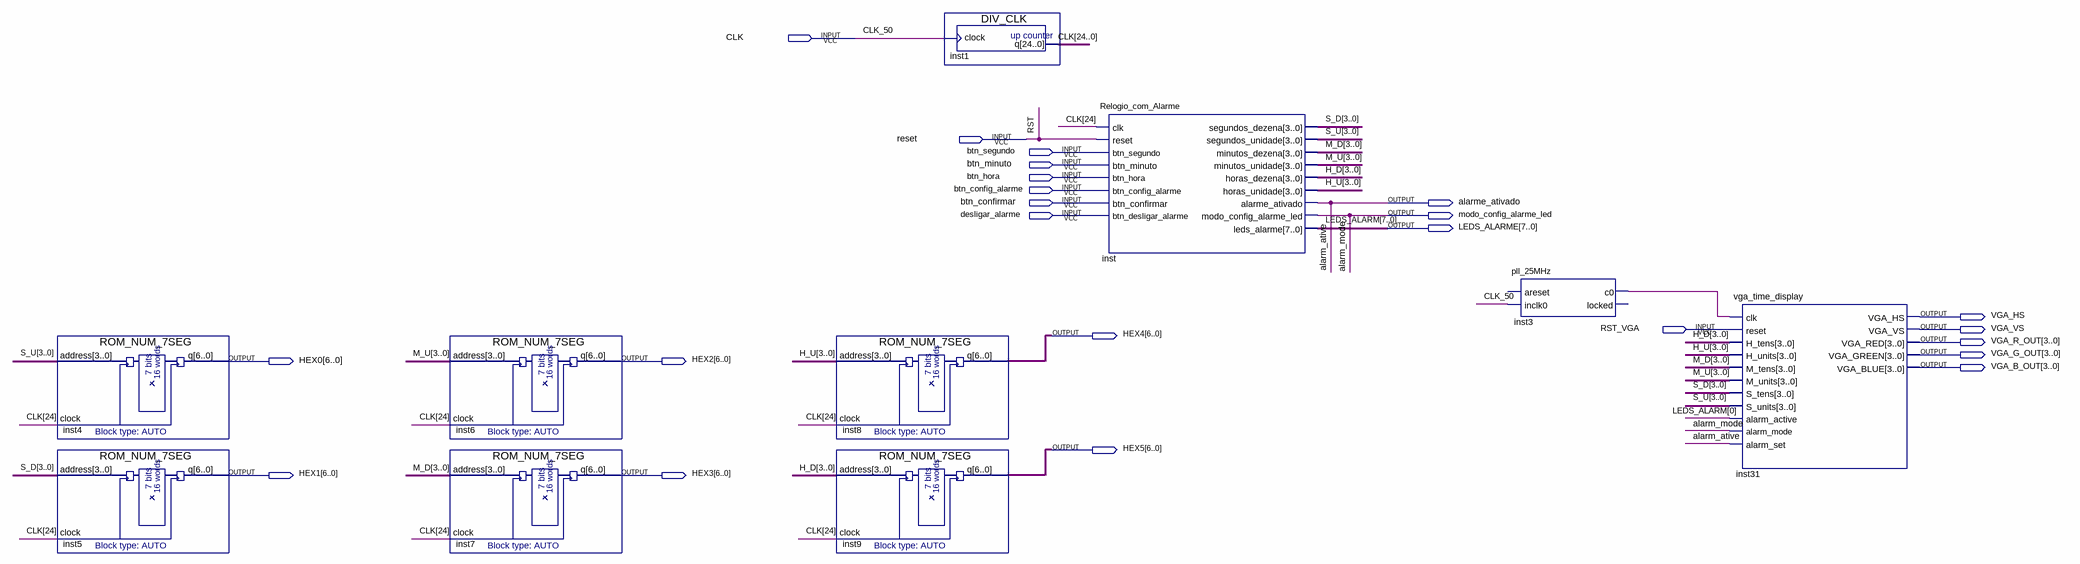
[diagram p0: schematic sheet]
// Quartus schematic Projeto_Final.bdf as structural Verilog: 10 symbols, 23 pins
module Projeto_Final (
  input  CLK,
  input  reset,
  input  btn_segundo,
  input  btn_minuto,
  input  btn_hora,
  input  btn_config_alarme,
  input  btn_confirmar,
  input  desligar_alarme,
  input  RST_VGA,
  output alarme_ativado,
  output modo_config_alarme_led,
  output [7:0] LEDS_ALARME,
  output VGA_HS,
  output VGA_VS,
  output [6:0] HEX4,
  output [3:0] VGA_R_OUT,
  output [3:0] VGA_G_OUT,
  output [6:0] HEX0,
  output [6:0] HEX2,
  output [3:0] VGA_B_OUT,
  output [6:0] HEX5,
  output [6:0] HEX1,
  output [6:0] HEX3
);

  wire inst3_c0;
  wire [3:0] H_D, H_U, M_D, M_U, S_D, S_U;
  wire [24:0] CLK_bus;

  ROM_NUM_7SEG inst4 (.address(S_U), .clock(CLK_bus[24]), .q(HEX0));
  ROM_NUM_7SEG inst5 (.address(S_D), .clock(CLK_bus[24]), .q(HEX1));
  ROM_NUM_7SEG inst6 (.address(M_U), .clock(CLK_bus[24]), .q(HEX2));
  ROM_NUM_7SEG inst7 (.address(M_D), .clock(CLK_bus[24]), .q(HEX3));
  ROM_NUM_7SEG inst8 (.address(H_U), .clock(CLK_bus[24]), .q(HEX4));
  ROM_NUM_7SEG inst9 (.address(H_D), .clock(CLK_bus[24]), .q(HEX5));
  DIV_CLK inst1 (.clock(CLK), .q(CLK_bus));
  Relogio_com_Alarme inst (
    .clk(CLK_bus[24]), .reset(reset), .btn_segundo(btn_segundo), .btn_minuto(btn_minuto),
    .btn_hora(btn_hora), .btn_config_alarme(btn_config_alarme), .btn_confirmar(btn_confirmar),
    .btn_desligar_alarme(desligar_alarme), .segundos_dezena(S_D), .segundos_unidade(S_U),
    .minutos_dezena(M_D), .minutos_unidade(M_U), .horas_dezena(H_D), .horas_unidade(H_U),
    .alarme_ativado(alarme_ativado), .modo_config_alarme_led(modo_config_alarme_led),
    .leds_alarme(LEDS_ALARME));
  pll_25MHz inst3 (.inclk0(CLK), .c0(inst3_c0));  // open: areset, locked
  vga_time_display inst31 (
    .clk(inst3_c0), .reset(RST_VGA), .H_tens(H_D), .H_units(H_U), .M_tens(M_D), .M_units(M_U), .S_tens(S_D),
    .S_units(S_U), .alarm_active(LEDS_ALARME[0]), .alarm_mode(modo_config_alarme_led),
    .alarm_set(alarme_ativado), .VGA_HS(VGA_HS), .VGA_VS(VGA_VS), .VGA_RED(VGA_R_OUT), .VGA_GREEN(VGA_G_OUT),
    .VGA_BLUE(VGA_B_OUT));

  // Other names for the same wires on the sheet: alarm_ative = alarme_ativado; CLK_50 = CLK;
  //   LEDS_ALARM[7:0] = LEDS_ALARME; alarm_mode = modo_config_alarme_led; RST = reset
endmodule
